# Altium schematic sheet REACTION-CIRCUIT-DISPLAY.SchDoc
size A4
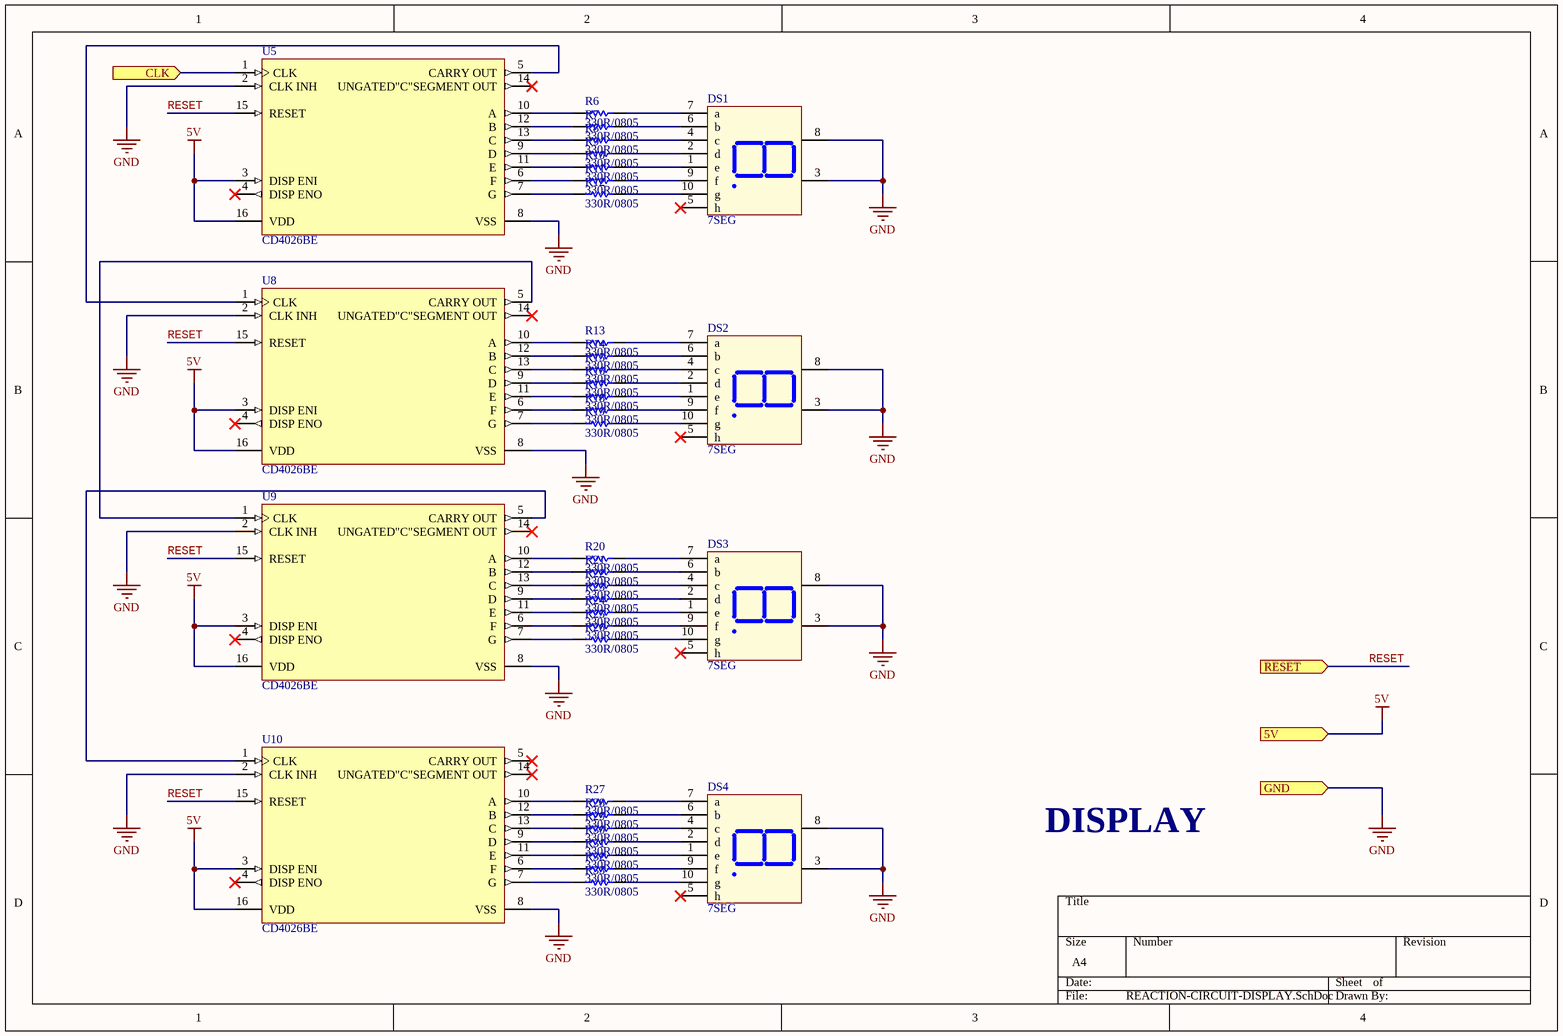
[diagram p0: REACTION-CIRCUIT-DISPLAY.SchDoc]

## Parts
DS1  7SEG  [LED7SEG-1-0.56]
DS2  7SEG  [LED7SEG-1-0.56]
DS3  7SEG  [LED7SEG-1-0.56]
DS4  7SEG  [LED7SEG-1-0.56]
R6  330R/0805  [Res 0805(2012)]
R7  330R/0805  [Res 0805(2012)]
R8  330R/0805  [Res 0805(2012)]
R9  330R/0805  [Res 0805(2012)]
R10  330R/0805  [Res 0805(2012)]
R11  330R/0805  [Res 0805(2012)]
R12  330R/0805  [Res 0805(2012)]
R13  330R/0805  [Res 0805(2012)]
R14  330R/0805  [Res 0805(2012)]
R15  330R/0805  [Res 0805(2012)]
R16  330R/0805  [Res 0805(2012)]
R17  330R/0805  [Res 0805(2012)]
R18  330R/0805  [Res 0805(2012)]
R19  330R/0805  [Res 0805(2012)]
R20  330R/0805  [Res 0805(2012)]
R21  330R/0805  [Res 0805(2012)]
R22  330R/0805  [Res 0805(2012)]
R23  330R/0805  [Res 0805(2012)]
R24  330R/0805  [Res 0805(2012)]
R25  330R/0805  [Res 0805(2012)]
R26  330R/0805  [Res 0805(2012)]
R27  330R/0805  [Res 0805(2012)]
R28  330R/0805  [Res 0805(2012)]
R29  330R/0805  [Res 0805(2012)]
R30  330R/0805  [Res 0805(2012)]
R31  330R/0805  [Res 0805(2012)]
R32  330R/0805  [Res 0805(2012)]
R33  330R/0805  [Res 0805(2012)]
U5  CD4026BE  [N0016A]
U8  CD4026BE  [N0016A]
U9  CD4026BE  [N0016A]
U10  CD4026BE  [N0016A]

## Ports
5V (in), CLK (in), GND (in), RESET (in)

## Nets
5V: U5.3(DISP_ENI) U5.16(VDD) U8.3(DISP_ENI) U8.16(VDD) U9.3(DISP_ENI) U9.16(VDD) U10.3(DISP_ENI) U10.16(VDD) ; port 5V
GND: DS1.3(Vcc) DS1.8(Vcc) DS2.3(Vcc) DS2.8(Vcc) DS3.3(Vcc) DS3.8(Vcc) DS4.3(Vcc) DS4.8(Vcc) U5.2(CLK_INH) U5.8(VSS) U8.2(CLK_INH) U8.8(VSS) U9.2(CLK_INH) U9.8(VSS) U10.2(CLK_INH) U10.8(VSS) ; port GND
CLK: U5.1(CLK) ; port CLK
RESET: U5.15(RESET) U8.15(RESET) U9.15(RESET) U10.15(RESET) ; port RESET
NetDS1_1: DS1.1(e) R10.1
NetDS1_2: DS1.2(d) R9.1
NetDS1_4: DS1.4(c) R8.1
NetDS1_6: DS1.6(b) R7.1
NetDS1_7: DS1.7(a) R6.1
NetDS1_9: DS1.9(f) R11.1
NetDS1_10: DS1.10(g) R12.1
NetDS2_1: DS2.1(e) R17.1
NetDS2_2: DS2.2(d) R16.1
NetDS2_4: DS2.4(c) R15.1
NetDS2_6: DS2.6(b) R14.1
NetDS2_7: DS2.7(a) R13.1
NetDS2_9: DS2.9(f) R18.1
NetDS2_10: DS2.10(g) R19.1
NetDS3_1: DS3.1(e) R24.1
NetDS3_2: DS3.2(d) R23.1
NetDS3_4: DS3.4(c) R22.1
NetDS3_6: DS3.6(b) R21.1
NetDS3_7: DS3.7(a) R20.1
NetDS3_9: DS3.9(f) R25.1
NetDS3_10: DS3.10(g) R26.1
NetDS4_1: DS4.1(e) R31.1
NetDS4_2: DS4.2(d) R30.1
NetDS4_4: DS4.4(c) R29.1
NetDS4_6: DS4.6(b) R28.1
NetDS4_7: DS4.7(a) R27.1
NetDS4_9: DS4.9(f) R32.1
NetDS4_10: DS4.10(g) R33.1
NetR6_2: R6.2 U5.10(A)
NetR7_2: R7.2 U5.12(B)
NetR8_2: R8.2 U5.13(C)
NetR9_2: R9.2 U5.9(D)
NetR10_2: R10.2 U5.11(E)
NetR11_2: R11.2 U5.6(F)
NetR12_2: R12.2 U5.7(G)
NetR13_2: R13.2 U8.10(A)
NetR14_2: R14.2 U8.12(B)
NetR15_2: R15.2 U8.13(C)
NetR16_2: R16.2 U8.9(D)
NetR17_2: R17.2 U8.11(E)
NetR18_2: R18.2 U8.6(F)
NetR19_2: R19.2 U8.7(G)
NetR20_2: R20.2 U9.10(A)
NetR21_2: R21.2 U9.12(B)
NetR22_2: R22.2 U9.13(C)
NetR23_2: R23.2 U9.9(D)
NetR24_2: R24.2 U9.11(E)
NetR25_2: R25.2 U9.6(F)
NetR26_2: R26.2 U9.7(G)
NetR27_2: R27.2 U10.10(A)
NetR28_2: R28.2 U10.12(B)
NetR29_2: R29.2 U10.13(C)
NetR30_2: R30.2 U10.9(D)
NetR31_2: R31.2 U10.11(E)
NetR32_2: R32.2 U10.6(F)
NetR33_2: R33.2 U10.7(G)
NetU5_5: U5.5(CARRY_OUT) U8.1(CLK)
NetU8_5: U8.5(CARRY_OUT) U9.1(CLK)
NetU9_5: U9.5(CARRY_OUT) U10.1(CLK)

Not connected (* = marked no-connect by the designer): DS1 5(h)*; DS2 5(h)*; DS3 5(h)*; DS4 5(h)*; U5 4(DISP_ENO)* 14(UNGATED"C"SEGMENT_OUT)*; U8 4(DISP_ENO)* 14(UNGATED"C"SEGMENT_OUT)*; U9 4(DISP_ENO)* 14(UNGATED"C"SEGMENT_OUT)*; U10 4(DISP_ENO)* 5(CARRY_OUT)* 14(UNGATED"C"SEGMENT_OUT)*

## Notes on the sheet
- DISPLAY

## Library data of the parts
DS1-DS4 = LED7SEG-1: 14.2 mm General Purpose Blue 7-Segment Display: CC, RH DP, Gray Surface; MinimumIntensity: 2020 ucd; Note: IF = 10 mA; Published: 8-Jun-2000; LatestRevisionDate: 17-Dec-2003; LatestRevisionNote: Schematic revised, PCB Footprint replaced.; DatasheetDocument: 24-Sep-2002; PackageDocument: 24-Sep-2002; PackageReference: H; Publisher: Altium Limited; Colour: Blue; ComponentLink1Description: Manufacturer Link; ComponentLink1URL: http://www.agilent.com/
R6-R33 = Resistor 0805
U5 U8-U10 = CMP-1623-00561-2: CMOS Decade Counter/Divider with Decoded 7-Segment Display Outputs and Display Enable, N0016A, TUBE; Manufacturer: Texas Instruments; ICC @ Nom Voltage(Max)(mA): 0.03; tpd @ Nom Voltage(Max)(ns): 250; F @ Nom Voltage(Max)(Mhz): 8; Bits(#): 7; VCC(Max)(V): 18; VCC(Min)(V): 3; Output Drive (IOL/IOH)(Max)(mA): 1.5/-1.5; Inputs: 1; Rating: Catalog; Technology Family: CD4000; Schmitt Trigger: No; Voltage(Nom)(V): 5,10,15; DatasheetVersion: SCHS031B; Operating Temperature Range(C): -55 to 125; Code_JEDEC: MS-001; Input Type: CMOS; Output Type: CMOS; Type: Decade; Generic Part Number: CD4026B; PackageReference: N0016A; Function: Counter